# Altium schematic sheet Sheet(sanya).SchDoc
size A4
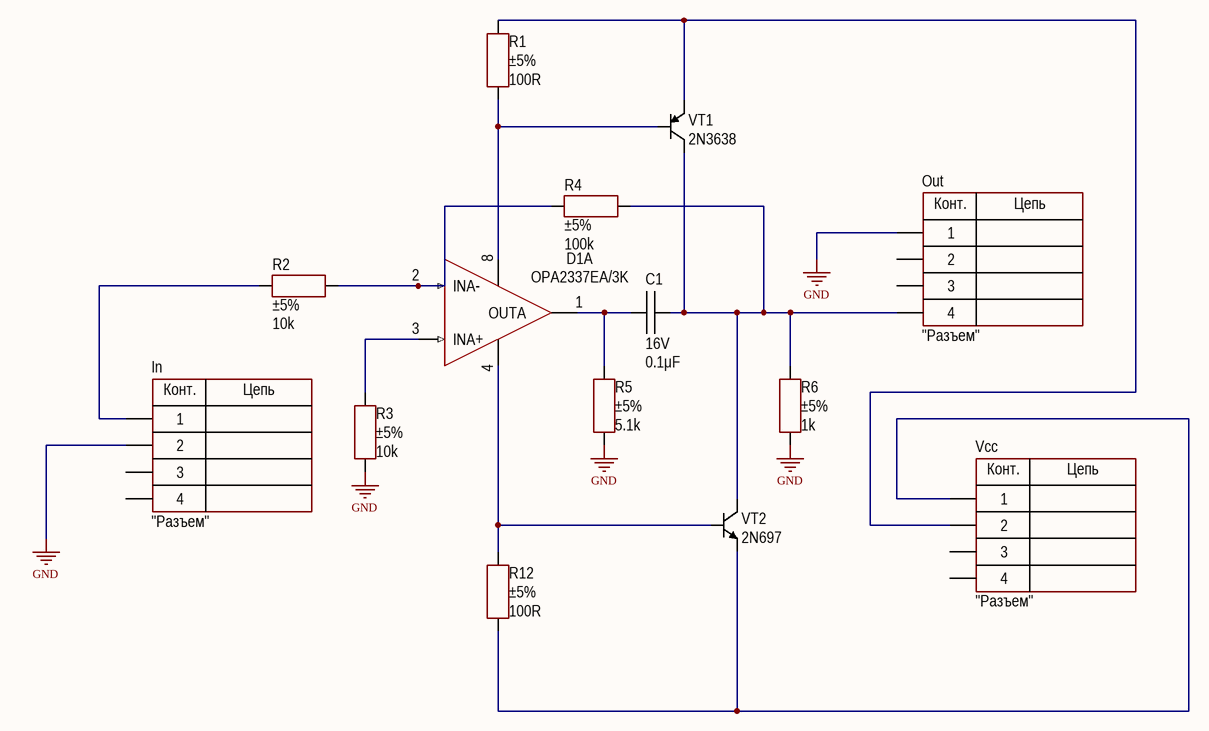
[diagram p0: Sheet(sanya).SchDoc]

## Parts
C1  value 0.1μF  Voltage: 16V  [CAP: 0201]
D1  (no value)  [SOT23-8]  (part A of 2)
In  CommentText: "Разъем"  [CON: SM04B-GHS]
Out  CommentText: "Разъем"  [CON: SM04B-GHS]
R1  value 100R  Tolerance: ±5%  [RES: 0402]
R2  value 10k  Tolerance: ±5%  [RES: 0402]
R3  value 10k  Tolerance: ±5%  [RES: 0402]
R4  value 100k  Tolerance: ±5%  [RES: 0402]
R5  value 5.1k  Tolerance: ±5%  [RES: 0402]
R6  value 1k  Tolerance: ±5%  [RES: 0402]
R12  value 100R  Tolerance: ±5%  [RES: 0402]
Vcc  CommentText: "Разъем"  [CON: SM04B-GHS]
VT1  PartNumber: 2N3638  [SOT23]
VT2  PartNumber: 2N697  [SOT23]

## Nets
GND: In.2 Out.1 R3.1 R5.2 R6.2
NetC1_1: C1.1 Out.4 R4.1 R6.1 VT1.2(C) VT2.2(C)
NetC1_2: C1.2 D1.1(OUTA) R5.1
NetD1_2: D1.2(INA-) R2.2 R4.2
NetD1_3: D1.3(INA+) R3.2
NetD1_4: D1.4(V-) R12.1 VT2.1(B)
NetD1_8: D1.8(V+) R1.1 VT1.1(B)
NetIn_1: In.1 R2.1
NetR1_2: R1.2 Vcc.2 VT1.3(E)
NetR12_2: R12.2 Vcc.1 VT2.3(E)

Not connected (* = marked no-connect by the designer): In 3 4; Out 2 3; Vcc 3 4

## Notes on the sheet
- (in symbol Connector_SM04B) Конт.; Цепь

## Library data of the parts
C1 = Ceramic_0201: Manufacturer: Yageo; PartNumber: CC0201KRX7R7BB103; ValueManufacturerPartNumber: Ceramic capacitor, 0.1μF, X7R, ±10%, 16V, 0201, -55...+125°C; TypeCapacitor: Ceramic capacitor; Tolerance: ±10%; TypeDielectric: X7R; Package: 0201; HelpURL: https://www.digikey.com/product-detail/en/yageo/CC0201KRX7R7BB103/311-1404-1-ND/2833710; Temperature: -55...+125°C
D1 = OPA2337EA/3K: OP amplifier; Manufacturer: Texas Instruments; ValueManufacturerPartNumber: IC op amplifier, Rail-to-Rail, 3 MHz, 2.7...5.5V, -40...+125°C, SOT23-5; Supply: 2.7...5.5V; OutputType: Rail-to-Rail; GainBandwidth: 3 MHz; HelpURL: https://www.digikey.com/product-detail/en/texas-instruments/OPA2337EA-3K/296-26252-1-ND/2254915; Package: SOT23-5; ComponentType: IC op amplifier; Temperature: -40...+125°C; PartNumber: OPA2337EA/3K
In Out Vcc = Connector_SM04B: Manufacturer: JST; ValueManufacturerPartNumber: Connector, 4pin, 1.25mm, 50VDC, 1A; PartNumber: SM04B-GHS; VoltageMax: 50VDC; Pitch: 1.25mm; CurrentMax: 1A; Multichannel: 4pin; HelpURL: https://www.digikey.com/product-detail/en/jst-sales-america-inc/SM04B-GHS-TB-LF-SN/455-1566-1-ND/807834; TypeConnector: Connector
R1 R12 = Resistor_0402: Manufacturer: Yageo; PartNumber: RC0402JR-07100RL; ValueManufacturerPartNumber: Resistor film, 100R, ±5%, 0402, 0.063W, -55...+125°C; TypeResistor: Resistor film; Power: 0.063W; Package: 0402; HelpURL: https://www.digikey.com/product-detail/en/yageo/RC0402JR-07100RL/311-100JRCT-ND/729362; Temperature: -55...+125°C
R2 R3 = Resistor_0402: Manufacturer: Yageo; PartNumber: RC0402JR-07100RL; ValueManufacturerPartNumber: Resistor film, 10k, ±5%, 0402, 0.063W, -55...+125°C; TypeResistor: Resistor film; Power: 0.063W; Package: 0402; HelpURL: https://www.digikey.com/product-detail/en/yageo/RC0402JR-07100RL/311-100JRCT-ND/729362; Temperature: -55...+125°C
R4 = Resistor_0402: Manufacturer: Yageo; PartNumber: RC0402JR-07100RL; ValueManufacturerPartNumber: Resistor film, 100k, ±5%, 0402, 0.063W, -55...+125°C; TypeResistor: Resistor film; Power: 0.063W; Package: 0402; HelpURL: https://www.digikey.com/product-detail/en/yageo/RC0402JR-07100RL/311-100JRCT-ND/729362; Temperature: -55...+125°C
R5 = Resistor_0402: Manufacturer: Yageo; PartNumber: RC0402JR-07100RL; ValueManufacturerPartNumber: Resistor film, 5.1k, ±5%, 0402, 0.063W, -55...+125°C; TypeResistor: Resistor film; Power: 0.063W; Package: 0402; HelpURL: https://www.digikey.com/product-detail/en/yageo/RC0402JR-07100RL/311-100JRCT-ND/729362; Temperature: -55...+125°C
R6 = Resistor_0402: Manufacturer: Yageo; PartNumber: RC0402JR-07100RL; ValueManufacturerPartNumber: Resistor film, 1k, ±5%, 0402, 0.063W, -55...+125°C; TypeResistor: Resistor film; Power: 0.063W; Package: 0402; HelpURL: https://www.digikey.com/product-detail/en/yageo/RC0402JR-07100RL/311-100JRCT-ND/729362; Temperature: -55...+125°C
VT1 = BJT_PNP_132: Manufacturer: ON Semiconductor; ValueManufacturerPartNumber: PNP transistor, 45V, 100mA, 100MHz, 300mW, 0.65V, 220, SOT-23, -55...+125°C; TypeTransistor: PNP transistor; VoltageCE: 45V; CurrentCE: 100mA; VoltageSaturation: 0.65V; Frequency: 100MHz; CurrentGain: 220; MaxPower: 300mW; Package: SOT-23; HelpURL: https://www.digikey.com/product-detail/en/on-semiconductor/BC857BLT3G/BC857BLT3GOSCT-ND/2704963; Temperature: -55...+125°C
VT2 = BJT_NPN_123: Manufacturer: ON Semiconductor; ValueManufacturerPartNumber: NPN transistor, 45V, 100mA, 100MHz, 300mW, 0.6V, 420, SOT-23, -55...+125°C; TypeTransistor: NPN transistor; VoltageCE: 45V; CurrentCE: 100mA; VoltageSaturation: 0.6V; Frequency: 100MHz; CurrentGain: 420; MaxPower: 300mW; Package: SOT-23; HelpURL: https://www.digikey.com/product-detail/en/on-semiconductor/BC847CLT1G/BC847CLT1GOSCT-ND/917836; Temperature: -55...+125°C